# EAGLE design lab (EAGLE 9.2.0)
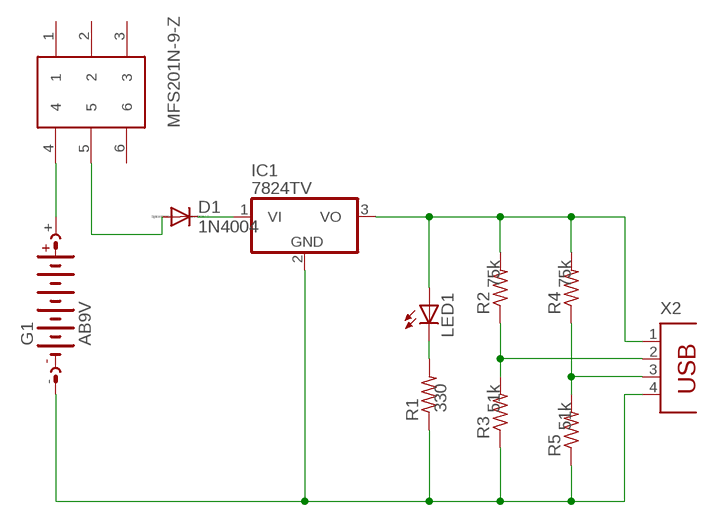
[diagram p0: schematic, sheet 1]

## Parts
D1  1N4004  [DO41-10]
G1  AB9V  [AB9V]
IC1  7824TV  [TO220V]
LED1  LED5MM  [LED5MM]
R1  R-US_0207/10  [0207/10]
R2  R-US_0207/10  [0207/10]
R3  R-US_0207/10  [0207/10]
R4  R-US_0207/10  [0207/10]
R5  R-US_0207/10  [0207/10]
U$1  MFS201N-9-Z  [MFS201N-9-Z]
X2  PN87520  [PN87520]

## Nets
N$1: G1.+ U$1.4
N$2: G1.- IC1.2(GND) R1.1 R3.1 R5.1 X2.4
N$3: D1.A U$1.5
N$4: D1.C IC1.1(VI)
N$5: IC1.3(VO) LED1.A R2.2 R4.2 X2.1
N$6: R2.1 R3.2 X2.2
N$7: R4.1 R5.2 X2.3
N$8: LED1.K(C) R1.2
Unconnected: U$1.1 U$1.2 U$1.3 U$1.6

## Library data of the parts
D1 = diode:1N4004: DIODE general purpose rectifier, 1 A
G1 = battery:AB9V: 9-V BATTERY CLIP
IC1 = linear:78*: Positive VOLTAGE REGULATOR Source: http://cache.national.com/ds/LM/LM78L05.pdf http://www.fairchildsemi.com/ds/LM/LM7805.pdf
LED1 = led:LED: LED OSRAM: - CHIPLED LG R971, LG N971, LY N971, LG Q971, LY Q971, LO R971, LY R971 LH N974, LH R974 LS Q976, LO Q976, LY Q976 LO Q996 - Hyper CHIPLED LW Q18S LB Q993, LB Q99A, LB R99A - SideLED LS A670, LO A670, LY A670, LG A670, LP A670 LB A673, LV A673, LT A673, LW A673 LH A674 LY A675 LS A676, LA A676, LO A676, LY A676, LW A676 LS A679, LY A679, LG A679 - Hyper Micro SIDELED® LS Y876, LA Y876, LO Y876, LY Y876 LT Y87S - SmartLED LW L88C, LW L88S LB L89C, LB L89S, LG L890 LS L89K, LO L89K, LY L89K LS L896, LA L896, LO L896, LY L896 - TOPLED LS T670, LO T670, LY T670, LG T670, LP T670 LSG T670, LSP T670, LSY T670, LOP T670, LYG T670 LG T671, LOG T671, LSG T671 LB T673, LV T673, LT T673, LW T673 LH T674 LS T676, LA T676, LO T676, LY T676, LB T676, LH T676, LSB T676, LW T676 LB T67C, LV T67C, LT T67C, LS T67K, LO T67K, LY T67K, LW E67C LS E67B, LA E67B, LO E67B, LY E67B, LB E67C, LV E67C, LT E67C LW T67C LS T679, LY T679, LG T679 LS T770, LO T770, LY T770, LG T770, LP T770 LB T773, LV T773, LT T773, LW T773 LH T774 LS E675, LA E675, LY E675, LS T675 LS T776, LA T776, LO T776, LY T776, LB T776 LHGB T686 LT T68C, LB T68C - Hyper Mini TOPLED® LB M676 - Mini TOPLED Santana® LG M470 LS M47K, LO M47K, LY M47K Source: http://www.osram.convergy.de LUXEON: - LUMILED® LXK2-PW12-R00, LXK2-PW12-S00, LXK2-PW14-U00, LXK2-PW14-V00 LXK2-PM12-R00, LXK2-PM12-S00, LXK2-PM14-U00 LXK2-PE12-Q00, LXK2-PE12-R00, LXK2-PE12-S00, LXK2-PE14-T00, LXK2-PE14-U00 LXK2-PB12-K00, LXK2-PB12-L00, LXK2-PB12-M00, LXK2-PB14-N00, LXK2-PB14-P00, LXK2-PB14-Q00 LXK2-PR12-L00, LXK2-PR12-M00, LXK2-PR14-Q00, LXK2-PR14-R00 LXK2-PD12-Q00, LXK2-PD12-R00, LXK2-PD12-S00 LXK2-PH12-R00, LXK2-PH12-S00 LXK2-PL12-P00, LXK2-PL12-Q00, LXK2-PL12-R00 Source: www.luxeon.com KINGBRIGHT: KA-3528ASYC Source: www.kingbright.com
R1 = rcl:R-US_: RESISTOR, American symbol; SPICEPREFIX: 330
R2 R4 = rcl:R-US_: RESISTOR, American symbol; SPICEPREFIX: 75k
R3 R5 = rcl:R-US_: RESISTOR, American symbol; SPICEPREFIX: 51k
U$1 = mfs:MFS201N-9-Z
X2 = con-berg:PN87520: BERG USB connector; OC_FARNELL: unknown; OC_NEWARK: unknown

## Board
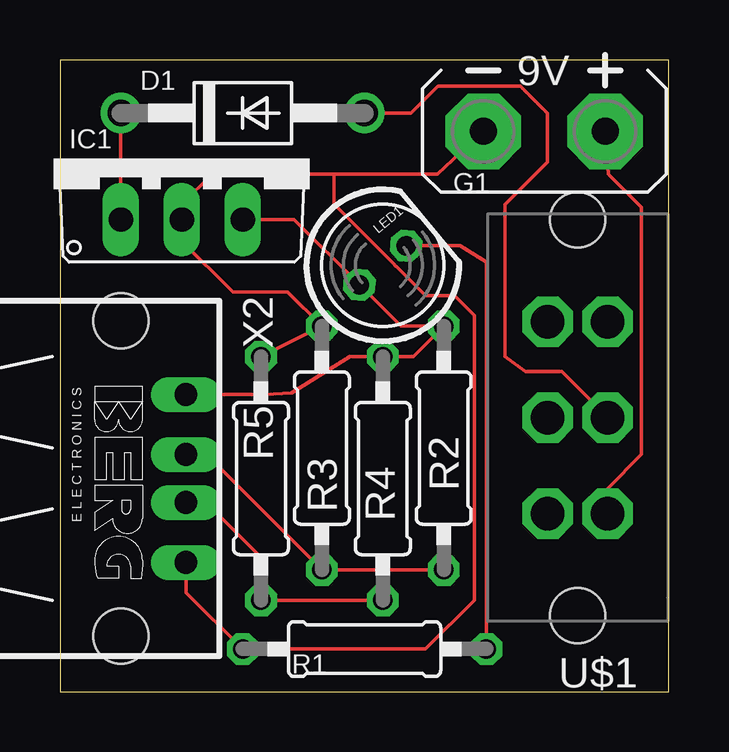
[diagram p1: board, top side]

Size 25.38 x 26.34 mm. Coordinates in mm from the lower left corner, seen from the top.
Outline: 0,0 25.38,0 25.38,26.34 0,26.34 0,0
Copper layers (1*16): Top 0.035mm / dielectric 1.5mm / Bottom 0.035mm
Design rules "default": minimum track width 6mil, minimum drill 0.35mm, track to track 6mil, track to pad 6mil, pad to pad 6mil, via to via 6mil, smd to smd 6mil, copper to edge 40mil, drill to drill 6mil, minimum pad ring 10mil, minimum via ring 8mil, stop-mask expansion 4mil, vias tented up to drill 0mil, thermal gap 10mil

### Footprints (pad centres in the part's own frame; a part is rotated, then mirrored left to right if it is on the bottom)
DO41-10 = drill 1.118: A 5.08,0; C -5.08,0
AB9V = drill 1.118 pad 3.15 octagon: + 0,2.54; - 0,-2.54
TO220V = drill 1.016 long: 1 -2.54,-2.54; 2 0,-2.54; 3 2.54,-2.54
LED5MM = drill 0.813 octagon: A -1.27,0; K 1.27,0
0207/10 = drill 0.813 octagon: 1 -5.08,0; 2 5.08,0
MFS201N-9-Z = drill 1.4 octagon: 1 1.25,4; 2 1.25,0; 3 1.25,-4; 4 -1.25,4; 5 -1.25,0; 6 -1.25,-4 | hole 2.3: 0,-8.25; 0,8.25
PN87520 = drill 0.95 long: 1 -3.5,2.71; 2 -1,2.71; 3 1,2.71; 4 3.5,2.71 | hole 2.3: -6.57,0; 6.57,0

### Placement (x,y rotation side)
D1  7.62,24.13 0 top
G1  20.19,23.37 270 top
IC1  5.08,22.23 0 top
LED1  13.46,17.78 39.8 top
R1  12.7,1.78 0 top
R2  16,10.16 90 top
R3  10.92,10.16 270 top
R4  13.46,8.89 90 top
R5  8.38,8.89 270 top
U$1  21.59,11.43 180 top
X2  2.54,8.89 270 top

### Tracks (layer width: path | path; a pad name or v marks a point on that pad's centre or on a via)
N$1
  Top 0.152: G1.+ 22.86,21.58 24.25,20.2 24.25,9.88 22.84,8.48 U$1.4
N$2
  Top 0.152: X2.4 5.25,4.13 R1.1 15.24,1.78 17.27,3.81 17.27,15.68 16.44,16.51 15.24,16.51 14.01,17.74 13.99,17.74 13.9,17.85 11.43,20.32 11.43,21.59 | R5.1 R3.1 9.5,16.66 7.21,16.66 5.08,18.79 IC1.2 5.08,20.32 6.35,21.59 11.43,21.59 | G1.- 15.75,21.59 11.43,21.59
N$3
  Top 0.152: U$1.5 20.93,13.34 19.42,13.34 18.54,13.97 18.54,20.3 20.32,22.08 20.32,24.13 19.2,25.25 15.76,25.25 14.64,24.13 D1.A
N$4
  Top 0.152: D1.C IC1.1
N$5
  Top 0.152: X2.1 8.54,12.39 9.65,12.45 12.09,13.97 R4.2 14.73,13.97 R2.2 14.21,15.24 LED1.A 9.77,19.68 IC1.3
N$6
  Top 0.152: X2.2 6.11,9.89 R3.2 R2.1
N$7
  Top 0.152: X2.3 6.1,7.89 8.21,5.79 8.21,3.98 R5.2 R4.1
N$8
  Top 0.152: LED1.K 16.68,18.59 17.78,17.91 R1.2